# Altium schematic sheet Adafruit 128x64 Mono OLED PCB v2.SchDoc: Adafruit 128x64 Mono OLED PCB v2
size 282 x 200 mm; Date: 18-May-19 7:31:38 PM; SheetNumber: 1; GateName_1: G$1; SymbolName_1: FRAME_A4_ADAFRUIT; LibraryName: microbuilder; DeviceSetName: FRAME_A4_ADAFRUIT
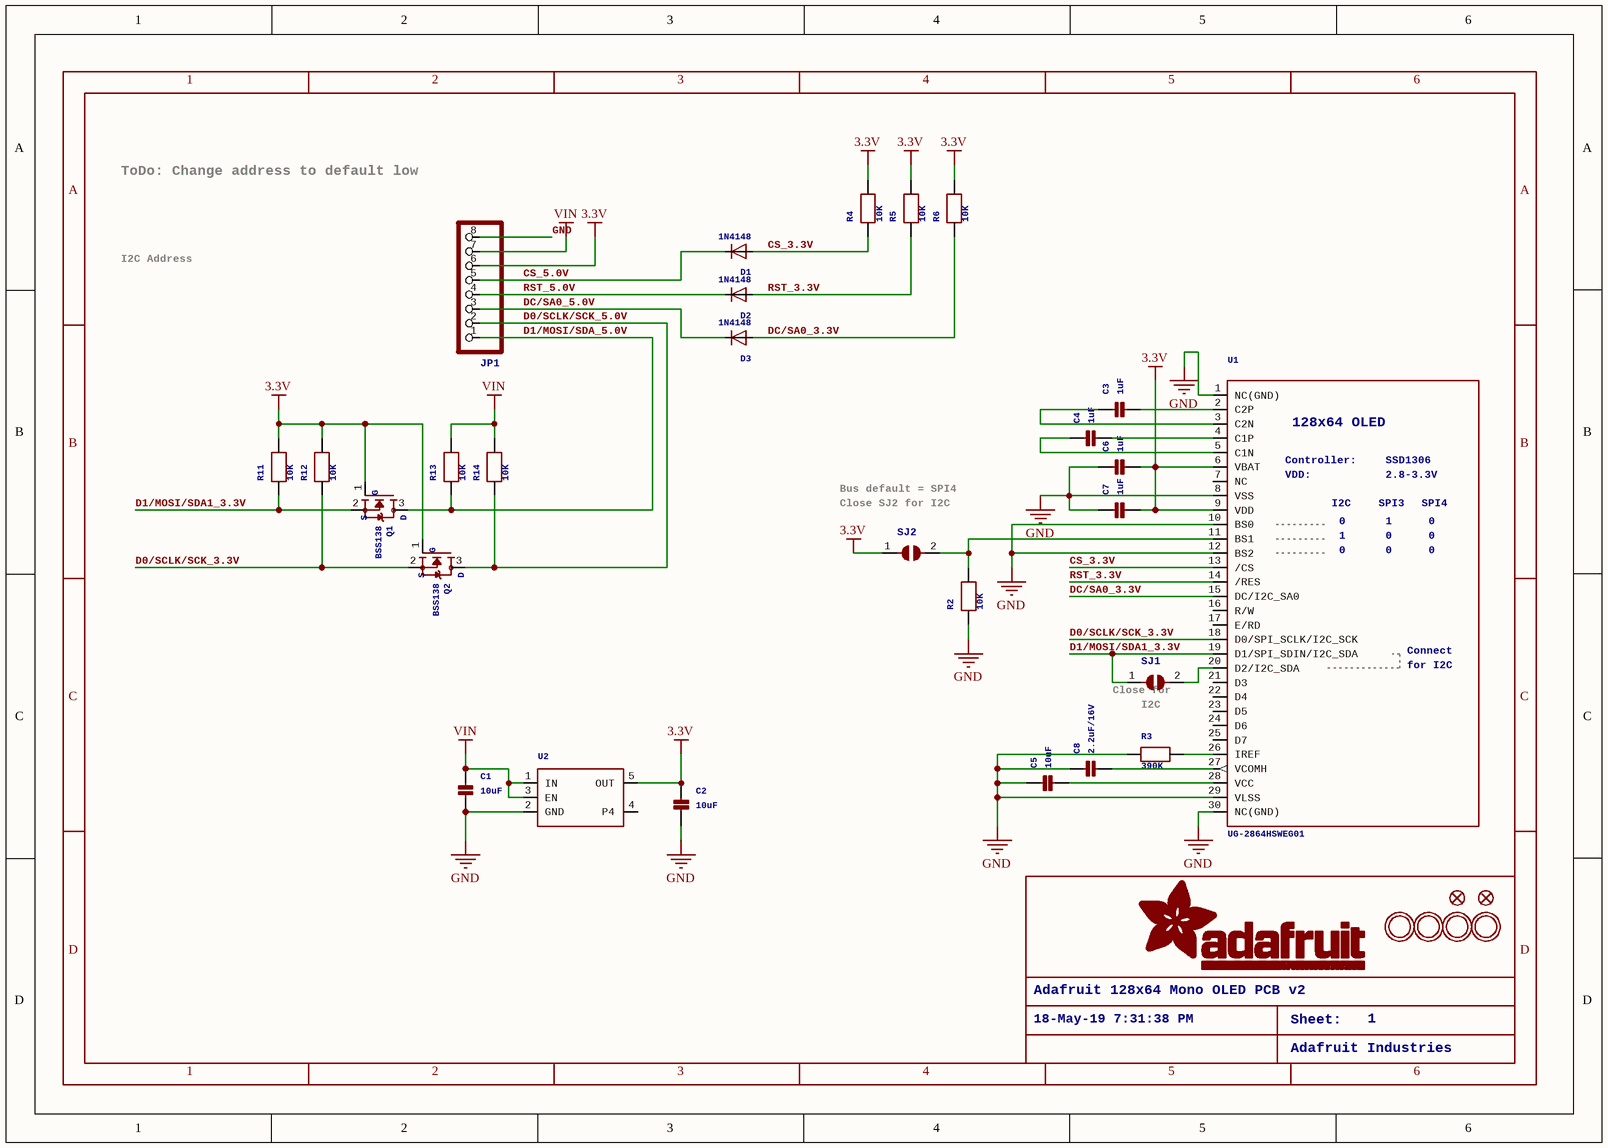
[diagram p0: Adafruit 128x64 Mono OLED PCB v2.SchDoc]

## Parts
C1  10uF  [0805]
C2  10uF  [0805]
C3  1uF  [0805]
C4  1uF  [0805]
C5  10uF  [0805]
C6  1uF  [0805]
C7  1uF  [0805]
C8  2.2uF/16V  [0805]
D1  1N4148  [SOD-323]
D2  1N4148  [SOD-323]
D3  1N4148  [SOD-323]
FID1  FIDUCIAL""  [FIDUCIAL_1MM]  (value not drawn)
FID2  FIDUCIAL""  [FIDUCIAL_1MM]  (value not drawn)
JP1  HEADER-1X870MIL  [1X08_ROUND_70]  (value not drawn)
Q1  BSS138  [SOT23-WIDE]
Q2  BSS138  [SOT23-WIDE]
R2  10K  [0805]
R3  390K  [0805]
R4  10K  [0805]
R5  10K  [0805]
R6  10K  [0805]
R11  10K  [0805]
R12  10K  [0805]
R13  10K  [0805]
R14  10K  [0805]
SJ1  SOLDERJUMPERREFLOW_NOPASTE  [SOLDERJUMPER_REFLOW_NOPASTE]  (value not drawn)
SJ2  SOLDERJUMPERREFLOW_NOPASTE  [SOLDERJUMPER_REFLOW_NOPASTE]  (value not drawn)
U1  UG-2864HSWEG01  128x64OLED: 128x64 OLED  forI2C: for I2C  Controller: Controller:  VDD: VDD:  [UG-2864HSWEG01_0.96IN_WRAPAROUND]
U2  VREG_SOT23-5  [SOT23-5]  (value not drawn)
U$23  MOUNTINGHOLE2.5  [MOUNTINGHOLE_2.5_PLATED]  (value not drawn)
U$24  MOUNTINGHOLE2.5  [MOUNTINGHOLE_2.5_PLATED]  (value not drawn)
U$25  MOUNTINGHOLE2.5  [MOUNTINGHOLE_2.5_PLATED]  (value not drawn)
U$26  MOUNTINGHOLE2.5  [MOUNTINGHOLE_2.5_PLATED]  (value not drawn)

## Nets
3.3V: C2.1(P$1) C6.2(P$2) C7.2(P$2) JP1.6 Q1.1(G) Q2.1(G) R4.2 R5.2 R6.2 R11.2 R12.2 SJ2.1 U1.6(VBAT) U1.9(VDD) U2.5(OUT)
GND: C1.2(P$2) C2.2(P$2) C5.1(P$1) C6.1(P$1) C7.1(P$1) C8.1(P$1) JP1.8 R2.1 R3.1 U1.1(NC(GND)) U1.8(VSS) U1.10(BS0) U1.12(BS2) U1.29(VLSS) U1.30(NC(GND)) U2.2(GND)
VIN: C1.1(P$1) JP1.7 R13.2 R14.2 U2.1(IN) U2.3(EN)
CS_3.3V: D1.A R4.1 U1.13(/CS)
CS_5.0V: D1.C JP1.5
D0/SCLK/SCK_3.3V: Q2.2(S) R12.1 U1.18(D0/SPI_SCLK/I2C_SCK)
D0/SCLK/SCK_5.0V: JP1.2 Q2.3(D) R14.1
D1/MOSI/SDA1_3.3V: Q1.2(S) R11.1 SJ1.1 U1.19(D1/SPI_SDIN/I2C_SDA)
D1/MOSI/SDA_5.0V: JP1.1 Q1.3(D) R13.1
DC/SA0_3.3V: D3.A R6.1 U1.15(DC/I2C_SA0)
DC/SA0_5.0V: D3.C JP1.3
RST_3.3V: D2.A R5.1 U1.14(/RES)
RST_5.0V: D2.C JP1.4
NetC3_1: C3.1(P$1) U1.3(C2N)
NetC3_2: C3.2(P$2) U1.2(C2P)
NetC4_1: C4.1(P$1) U1.5(C1N)
NetC4_2: C4.2(P$2) U1.4(C1P)
NetC5_2: C5.2(P$2) U1.28(VCC)
NetC8_2: C8.2(P$2) U1.27(VCOMH)
NetR2_2: R2.2 SJ2.2 U1.11(BS1)
NetR3_2: R3.2 U1.26(IREF)
NetSJ1_2: SJ1.2 U1.20(D2/I2C_SDA)

Not connected (* = marked no-connect by the designer): U1 7(NC) 16(R/W) 17(E/RD) 21(D3) 22(D4) 23(D5) 24(D6) 25(D7); U2 4(P4)

## Notes on the sheet
- ToDo: Change address to default low
- I2C Address
- Bus default = SPI4
- (near SJ2) Close SJ2 for I2C
- (near SJ1) Close for
- (near SJ1) I2C
- Adafruit 128x64 Mono OLED PCB v2
- 18-May-19 7:31:38 PM
- Sheet:
- 1
- Adafruit Industries
- 2
- 3
- 4
- 5
- 6
- A
- B
- C
- D

## Library data of the parts
C1-C8 = CAP_CERAMIC0805: Ceramic Capacitors0402 - 0402 Surface Mount Capacitors 0603 - 0603 Surface Mount Capacitors 0603 - RF Specific 0805 - 0805 Surface Mount Capacitors 1206 - 1206 Surface Mount Capacitors; GateName_1: G$1; SymbolName_1: CAPACITOR; DeviceName: 0805; LibraryName: microbuilder; DeviceSetName: CAP_CERAMIC
D1-D3 = DIODESOD-323: DiodeSMA  Model  Volts  Amps  Type  Vf  Vr  Digikey #  Notes  SSA34-E3  40V  3A  Schottky  480mV @ 3A  200uA @ 40V  SSA34-E3/61TGITR-ND    CDBA120-G  20V  1A  Schottky  500mV @ 1A  500uA @ 20V  641-1014-6-ND  REEL  MBRA210  10V  2A  Schottky  350mV @ 2A  700uA @ 10V  MBRA210LT3  SOD-123  Model  Volts  Amps  Type  Vf  Vr  Order #  Notes  BAT54T1G  30V  200mA  Schottky  800mV @ 200mA  2uA @ 25V  BAT54T1GOSTR-ND    B0530W  30V  500mA  Schottky  430mV @ 500mA  130uA @ 30V  B0530W-FDICT-ND  REEL  MBR120  1A  20V  Schottky  340mV @ 1A    MBR120VLSFT1GOSCT-ND  SOD-323  Model  Volts  Amps  Type  Vf  Vr  Order #  Notes  ZLLS410  10V  570mA  Schottky  380mV @ 570mA    ZLLS410CT-ND    1N4148WS  75V  150mA  Silicon/Simple  1V    1N4148WSFSCT-ND  REELSOD-523  Model  Volts  Amps  Type  Vf  Vr  Order #  Notes  BAT54XV2  30V  200mA  Schottky  0.8V @ 100mA    BAT54XV2CT-ND    TB751S  30V  30mA  Schottky      RB751S-40TE61CT-ND  SOT23-R/W(R = Solder Paste/Reflow Ovens, W = Hand-Soldering)   Model  Volts  Amps  Type  Vf  Vr  Order #  Notes  BAT54FILM  40V  300mA  Schottky      497-7162-1-ND; GateName_1: G$1; SymbolName_1: DIODE; DeviceName: SOD-323; LibraryName: microbuilder; DeviceSetName: DIODE
FID1 FID2 = FIDUCIAL"": Fiducial Alignment PointsVarious fiducial points for machine vision alignment.; GateName_1: G$1; DeviceName: ""; SymbolName_1: FIDUCIAL; LibraryName: microbuilder; DeviceSetName: FIDUCIAL
JP1 = HEADER-1X870MIL: PIN HEADER; GateName_1: A; SymbolName_1: PINHD8; DeviceName: 70MIL; LibraryName: microbuilder; DeviceSetName: HEADER-1X8
Q1 Q2 = MOSFET-NWIDE: N-Channel MosfetLEGENDVDS: Voltage Drain-SourceID: Drain CurrentRDS(ON): Drain-Source On-State ResistanceVGS(TH): Gate-Source Threshold VoltageCISS: Drain-Source Input Capacitance SOT-23NameVDSIDRDS(ON)VGS(TH)CISSOrder Number2N7002E60V260mA2.5 Ohm2.5V @ 250uA26.7pF @ 25V2N7002ET1GOSTR-NDBSH10330V850mA400 mOhm400mV @ 1mA83pF @ 24VBSH103,235-NDBSS13860V320mA1.6 Ohm1.5V @ 250uA50pF @ 10VMouser: 771-BSS138PW115* BSS138 good choice for I2C level-shifting; GateName_1: G$1; DeviceName: WIDE; SymbolName_1: MOSFET-N; LibraryName: microbuilder; DeviceSetName: MOSFET-N; D: D; S: S; G: G
R2-R6 R11-R14 = RESISTOR0805: Resistors0402 - 0402 Surface Mount Package 0603 - 0603 Surface Mount Package0805 - 0805 Surface Mount Package 1206 - 1206 Surface Mount Package2012 - 2010 Surface Mount Package; GateName_1: G$1; SymbolName_1: RESISTOR; DeviceName: 0805; LibraryName: microbuilder; DeviceSetName: RESISTOR
SJ1 SJ2 = SOLDERJUMPERREFLOW_NOPASTE: SMD Solder JUMPERSolder the two pads together to create a connection, or remove the solder to break it.REFLOW - Use this footprint for solder paste and reflow ovens.WAVE - Use this footprint for hand-soldering (larger pads). CLOSED - Has a trace between the two pads to ensure it is closed by default.  The trace needs to be cut to disable the jumper, and can be closed again by creating a solder bridge between the two pads.; GateName_1: 1; SymbolName_1: SOLDERJUMPER; DeviceName: REFLOW_NOPASTE; LibraryName: microbuilder; DeviceSetName: SOLDERJUMPER
U1 = DISP_OLED_UG-2864HSWEG010.96": UG-2864HSWEG01 OLED display Both 1.3" and 0.96" models share the same FPC tab footprint, only the screen dimensions vary.; GateName_1: G$1; SymbolName_1: UG-2864HSWEG01; DeviceName: 0.96"; LibraryName: microbuilder; DeviceSetName: DISP_OLED_UG-2864HSWEG01; I2C: I2C; SPI3: SPI3; 0: 0; 1: 1; Connect: Connect; SSD1306: SSD1306; 2.8-3.3V: 2.8-3.3V; SPI4: SPI4
U2 = VREG_SOT23-5: SOT23-5 Fixed Voltage RegulatorsTo better organise some of the SOT23-5 fixed voltage regulators in this library, this new part was created.PartCurrent OutV OutV InV DropoutDigikey Part No.  ADP121  150mA  3.3V  3.4-5.5V  0.09V @ 150mA  ADP121-AUJZ33R7CT-ND  ADP121  150mA  3.0V  3.1-5.5V  0.09V @ 150mA  ADP121-AUJZ30R7CT-ND  ADP122     300mA  3.3V  3.4-5.5V  0.085V @ 300mA  ADP122AUJZ-3.3-R7CT-ND  ADP1712     300mA  3.3V  3.5-5.5V  0.17V @ 300mA  ADP1712AUJZ-3.3-R7TR-ND  AP7311 (Low Cost)  150mA  3.3V  3.5-6V  0.15V @ 150mA  AP7311-33WG-7DICT-ND  LD39015M18R  150mA  1.8V  1.9V-5.5V  0.08V @ 100mA  497-6977-1-ND  MCP1824T-3302E/OT  300mA  3.3V  3.5V-6V  0.2V @ 300mA  MCP1824T-3302E/OTCT-ND  MIC5205-2.5YM5 TR  150mA  2.5V  2.7-16V  0.165V @ 150mA  576-1257-2-ND  MIC5205-3.0YM5 TR  150mA  3.0V  3.2V-16V  0.165V @ 150mA  576-1258-2-ND  MIC5205-3.3YM5 TR  150mA  3.3V  3.5V-16V  0.165V @ 150mA  576-1259-2-ND  TPS780330220  150mA  3.3V+2.2V  3.6-5.5V  250mV Max  296-23332-1-ND  TDA3663/N1,135  100mA  3.3V  3.5-45V  0.18V @ 50mA  568-5343-1-ND; GateName_1: G$1; SymbolName_1: VREG_SOT23-5; LibraryName: microbuilder; DeviceSetName: VREG_SOT23-5
U$23-U$26 = MOUNTINGHOLE2.5: Mounting HoleFor #2 screws (0.086"/2.18mm width, 0.094"/2.4mm hole) use 2.5mm; GateName_1: G$1; DeviceName: 2.5; SymbolName_1: MOUNTINGHOLE; LibraryName: microbuilder; DeviceSetName: MOUNTINGHOLE